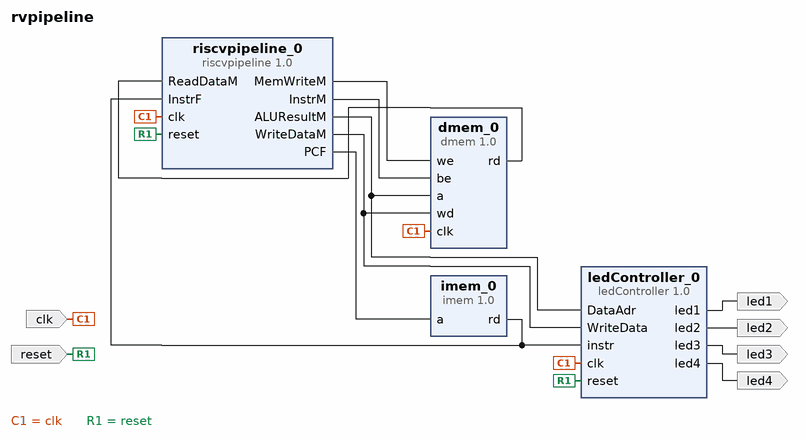
[diagram p0: block diagram of the top level]
# Vivado block design rvpipeline, xc7z010clg400-1, Vivado 2019.2
create_bd_design rvpipeline

create_bd_port -dir I -type rst reset
set_property -dict {CONFIG.POLARITY ACTIVE_HIGH} [get_bd_ports reset]
create_bd_port -dir I -type clk clk
set_property -dict {CONFIG.FREQ_HZ 142857143} [get_bd_ports clk]
create_bd_port -dir O led1
create_bd_port -dir O led3
create_bd_port -dir O led2
create_bd_port -dir O led4

create_bd_cell -type ip -vlnv user.org:user:dmem:1.0 dmem_0
create_bd_cell -type ip -vlnv user.org:user:ledController:1.0 ledController_0
create_bd_cell -type ip -vlnv user.org:user:riscvpipeline:1.0 riscvpipeline_0
create_bd_cell -type ip -vlnv user.org:user:imem:1.0 imem_0

# ---- connections ----

connect_bd_net [get_bd_ports clk] [get_bd_pins ledController_0/clk] [get_bd_pins dmem_0/clk] [get_bd_pins riscvpipeline_0/clk]
connect_bd_net [get_bd_ports reset] [get_bd_pins ledController_0/reset] [get_bd_pins riscvpipeline_0/reset]
connect_bd_net [get_bd_pins imem_0/rd] [get_bd_pins ledController_0/instr] [get_bd_pins riscvpipeline_0/InstrF]
connect_bd_net [get_bd_pins riscvpipeline_0/ALUResultM] [get_bd_pins dmem_0/a] [get_bd_pins ledController_0/DataAdr]
connect_bd_net [get_bd_pins riscvpipeline_0/WriteDataM] [get_bd_pins dmem_0/wd] [get_bd_pins ledController_0/WriteData]
connect_bd_net [get_bd_pins riscvpipeline_0/MemWriteM] [get_bd_pins dmem_0/we]
connect_bd_net [get_bd_pins riscvpipeline_0/PCF] [get_bd_pins imem_0/a]
connect_bd_net [get_bd_pins dmem_0/rd] [get_bd_pins riscvpipeline_0/ReadDataM]
connect_bd_net [get_bd_pins ledController_0/led1] [get_bd_ports led1]
connect_bd_net [get_bd_pins ledController_0/led3] [get_bd_ports led3]
connect_bd_net [get_bd_pins ledController_0/led2] [get_bd_ports led2]
connect_bd_net [get_bd_pins ledController_0/led4] [get_bd_ports led4]
connect_bd_net [get_bd_pins riscvpipeline_0/InstrM] [get_bd_pins dmem_0/be]

validate_bd_design
save_bd_design
